# Altium schematic sheet Sheet1.SchDoc
size A4
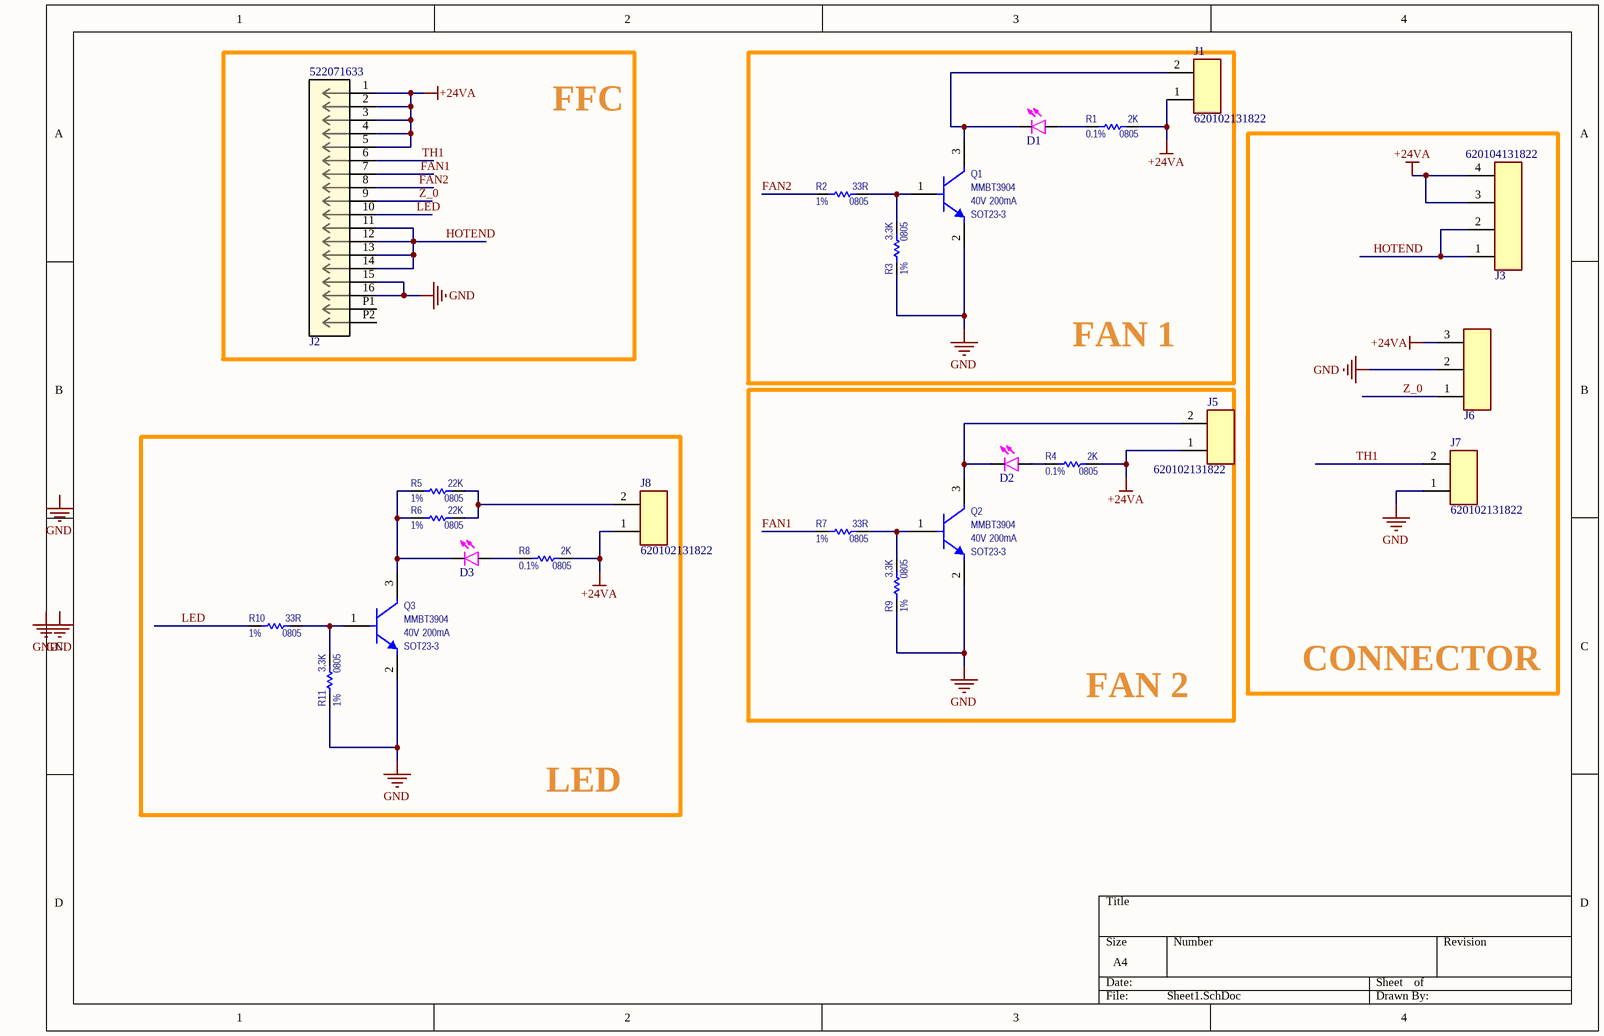
[diagram p0: Sheet1.SchDoc]

## Parts
D1  KP-2012SRC-PRV  [0805 LED]  (value not drawn)
D2  KP-2012SRC-PRV  [0805 LED]  (value not drawn)
D3  KP-2012SRC-PRV  [0805 LED]  (value not drawn)
J1  620102131822  [620102131822]
J2  522071633  [CON_522071633_MOL]
J3  620104131822  [620104131822]
J5  620102131822  [620102131822]
J6  620103131822  [620103131822]  (value not drawn)
J7  620102131822  [620102131822]
J8  620102131822  [620102131822]
Q1  value MMBT3904  Current: 200mA  Voltage: 40V  Package: SOT23-3  [SOT23-3_MMBT3904,215]  (hidden comment: SingleNPN_B1E2C3)
Q2  value MMBT3904  Current: 200mA  Voltage: 40V  Package: SOT23-3  [SOT23-3_MMBT3904,215]  (hidden comment: SingleNPN_B1E2C3)
Q3  value MMBT3904  Current: 200mA  Voltage: 40V  Package: SOT23-3  [SOT23-3_MMBT3904,215]  (hidden comment: SingleNPN_B1E2C3)
R1  value 2K  Tolerance: 0.1%  Package: 0805  [R_0805_GEN_0.70H]  (hidden comment: StandardResistor)
R2  value 33R  Tolerance: 1%  Package: 0805  [R_0805_GEN_0.70H]  (hidden comment: StandardResistor)
R3  value 3.3K  Tolerance: 1%  Package: 0805  [R_0805_GEN_0.70H]  (hidden comment: StandardResistor)
R4  value 2K  Tolerance: 0.1%  Package: 0805  [R_0805_GEN_0.70H]  (hidden comment: StandardResistor)
R5  value 22K  Tolerance: 1%  Package: 0805  [R_0805_GEN_0.70H]  (hidden comment: StandardResistor)
R6  value 22K  Tolerance: 1%  Package: 0805  [R_0805_GEN_0.70H]  (hidden comment: StandardResistor)
R7  value 33R  Tolerance: 1%  Package: 0805  [R_0805_GEN_0.70H]  (hidden comment: StandardResistor)
R8  value 2K  Tolerance: 0.1%  Package: 0805  [R_0805_GEN_0.70H]  (hidden comment: StandardResistor)
R9  value 3.3K  Tolerance: 1%  Package: 0805  [R_0805_GEN_0.70H]  (hidden comment: StandardResistor)
R10  value 33R  Tolerance: 1%  Package: 0805  [R_0805_GEN_0.70H]  (hidden comment: StandardResistor)
R11  value 3.3K  Tolerance: 1%  Package: 0805  [R_0805_GEN_0.70H]  (hidden comment: StandardResistor)

## Blocks framed on the sheet
FFC: J2
FAN 1: D1 J1 Q1 R1-R3
CONNECTOR: J3 J6 J7
FAN 2: D2 J5 Q2 R4 R7 R9
LED: D3 J8 Q3 R5 R6 R8 R10 R11

## Nets
+24VA: J1.1 J2.1 J2.2 J2.3 J2.4 J2.5 J3.3 J3.4 J5.1 J6.3 J8.1 R1.2 R4.2 R8.2
GND: J2.15 J2.16 J6.2 J7.1 Q1.2(EMITTER) Q2.2(EMITTER) Q3.2(EMITTER) R3.1 R9.1 R11.1
FAN1: J2.7 R7.1
FAN2: J2.8 R2.1
HOTEND: J2.11 J2.12 J2.13 J2.14 J3.1 J3.2
LED: J2.10 R10.1
TH1: J2.6 J7.2
Z_0: J2.9 J6.1
NetD1_A: D1.A R1.1
NetD1_K: D1.K(C) J1.2 Q1.3(COLLECTOR)
NetD2_A: D2.A R4.1
NetD2_K: D2.K(C) J5.2 Q2.3(COLLECTOR)
NetD3_A: D3.A R8.1
NetD3_K: D3.K(C) Q3.3(COLLECTOR) R5.1 R6.1
NetJ8_2: J8.2 R5.2 R6.2
NetQ1_1: Q1.1(BASE) R2.2 R3.2
NetQ2_1: Q2.1(BASE) R7.2 R9.2
NetQ3_1: Q3.1(BASE) R10.2 R11.2

Not connected (* = marked no-connect by the designer): J2 P1 P2

## Notes on the sheet
- Labels drawn without touching a wire or pin: GND

## Library data of the parts
D1-D3 = KP-2012SRC-PRV: KP-2012SRC-PRV Red LED, 640 nm 2012 (0805), Rectangle Lens SMD package; Manufacturer: Kingbright; Lens Color: Clear; Viewing Angle: 120°; Lens Style: Rectangular,Diffused,Colorless; Number of LEDs: 1; Wavelength: 640nm; Luminous Intensity: 100mcd; Forward Voltage: 1.85V; Forward Current: 20mA; Supplier 1: Farnell; Manufacturer Part Number: KP-2012SRC-PRV; RoHS: Yes; Category: LEDs; Pricing 1: 5=0,12900, 50=0,10200, 100=0,09830, 500=0,08370, 1000=0,07290 (EUR); Mount: Surface Mount; Case/Package: 2012; Number of Pins: 2; Color: Red; Min Operating Temperature: -40°C; Max Operating Temperature: 85°C; Packaging: Cut Tape; Dominant Wavelength: 640nm; Radiation Hardening: No; Reach SVHC Compliant: Yes; RoHS Compliant: Yes; ComponentLink1URL: https://datasheet.ciiva.com/14176/kp2012src-prv-eng-tds-14176962.pdf?src-supplier=Distrelec; ComponentLink1Description: https://datasheet.ciiva.com/14176/kp2012src-prv-eng-tds-14176962.pdf?src-supplier=Distrelec; ComponentLink2URL: https://datasheet.ciiva.com/11773/0900766b8032fa8d-11773524.pdf?src-supplier=RSComponents; ComponentLink2Description: https://datasheet.ciiva.com/11773/0900766b8032fa8d-11773524.pdf?src-supplier=RSComponents; ComponentLink3URL: https://datasheet.ciiva.com/14634/0900766b8032fa8d-14634746.pdf?src-supplier=Allied+Electronics; ComponentLink3Description: https://datasheet.ciiva.com/14634/0900766b8032fa8d-14634746.pdf?src-supplier=Allied+Electronics; ComponentLink4URL: https://datasheet.ciiva.com/29281/180105-da-01-en-led-0805-typ-kp-2012src-prv-29281248.pdf?src-supplier=Conrad; ComponentLink4Description: https://datasheet.ciiva.com/29281/180105-da-01-en-led-0805-typ-kp-2012src-prv-29281248.pdf?src-supplier=Conrad; Supplier Part Number 1: 1318244
J1 J5 J7 J8 = 620102131822: Connector Header Surface Mount, Right Angle 2 position 0.079 _2.00mm_; MF: Wurth Electronics; MP: 620102131822; Price: None; SnapEDA_Link: https://www.snapeda.com/parts/620102131822/Wurth%20Electronics%20Inc./view-part/424042/?ref=snap; Package: None; Value: *; Availability: Unavailable
J2 = 522071633: No Description Available; Mfr_Name: Molex Connector Corporation; RefDes: RefDes; Type: Type
J3 = 620104131822: <b> WR-WTB 2.00mm SMT Male Horizontal Shrouded Header, 4 Pins</b>=>Code : Con_WTB_2.00_PCB_SMT_620104131822 <br><a href="http://katalog.we-online.de/media/thumbs2/eican/thb_Con_WTB_2.00_PCB_SMT_6201xx131822_pf2.jpg" title="Enlarge picture"> <img src="http://katalog.we-online.de/media/thumbs2/eican/thb_Con_WTB_2.00_PCB_SMT_6201xx131822_pf2.jpg"  width="320"></a><p> Details see: <a href="http://katalog.we-online.de/en/em/WTB_2_00_SMT_MALE_HORIZONTAL_SHROUDED_HEADER_6201XX131822">http://katalog.we-online.de/en/em/WTB_2_00_SMT_MALE_HORIZONTAL_SHROUDED_HEADER_6201XX131822</a><p> Created 2014-06-05, Karrer Zheng<br> 2014 (C) WÃ¼rth Elektronik; Package: None; Price: None; Value: *; MP: 620104131822; Availability: Unavailable
J6 = 620103131822: Connector Header Surface Mount, Right Angle 3 position 0.079 (2.00mm); MF: Wurth Electronics; MP: 620103131822; SnapEDA_Link: https://www.snapeda.com/parts/620103131822/Wurth%20Electronics%20Inc./view-part/1330579/?ref=snap; Mouser-Purchase-URL: https://snapeda.com/shop?store=Mouser&id=1330579; Price: None; Availability: Warning; Package: None; Value: *
Q1-Q3 = NPN_40V-200mA_#1: TRA_NPN_SING_40V_200mA_VSAT300mV_SOT23-3; Manufacturer#1: Nexperia; Manufacturer#1 PN: MMBT3904,215; Manufacturer#2 PN: MMBT3904-7-F; Similar Part: SST3904HZGT116; PMBT3904,235; Added by: HasanA; FireANTs Code: Q00012; Failure in Time: 0.44@[60%CL; 55°C; 0.7eV]; Grade Level: Industrial; Lead Status: Pb-Free; Location: 4D3; Max Reflow Duration: 30; Max Reflow Temp: 260; Placement Area: 14.00; Power Rating: X; Temp# Operating: -65°C/+150°C; Identifier: NPN_40V-200mA_#1; Checked by: EserC; ComponentLink1Description: Resource Folder; ComponentLink1URL: C:\BNA_Repo\HW_Lib\trunk\ComponentLibrary\Resources\Transistors\Q00012; Cost: 0.10; Features: Single NPN signal BJT; Height: 1.10; Manufacturer#2: Diodes; MSL: 1; Mounting Type: SMD; Part Status: Active; Temp# Storage: -65°C/+150°C; Tolerance: X; Weight: 7.48mg
R1 R4 R8 = STD_2K_#7: RES_STD_2K_0.125W_0.1%_25ppm_0805; Manufacturer#1: Panasonic; Manufacturer#1 PN: ERA-6AEB202V; Manufacturer#2 PN: RG2012P-202-B-T5; Similar Part: ERA-6ARB202V; Added by: İlhanT; FireANTs Code: R00087; Current: X; Grade Level: Automotive; Lead Status: Pb-Free; Location: 2C22; Max Reflow Duration: 10; Max Reflow Temp: 260; Placement Area: 10.45; Power Rating: 125mW; Temp# Operating: -55°C/+155°C; Voltage: 100V; Identifier: STD_2K_#7; Checked by: YasinY; ComponentLink1Description: Resource Folder; ComponentLink1URL: C:\FireANTs_Repo\HW_Lib\trunk\ComponentLibrary\Resources\Resistors\R00087; Cost: 0.31; Failure in Time: N/A; Features: AEC-Q200; Height: 0.70; Manufacturer#2: Susumu; MSL: 1; Mounting Type: SMD; Part Status: Active; Temp# Storage: N/A; Weight: 5.5mg
R2 R5-R7 R10 = STD_33R_#3: RES_STD_33R_0.125W_1%_100ppm_0805; Manufacturer#1: Yageo; Manufacturer#1 PN: AC0805FR-0733RL; Manufacturer#2 PN: ERJ-6ENF33R0V; Added by: HasanA; FireANTs Code: R00051; Current: X; Grade Level: Automotive; Lead Status: Pb-Free; Location: 2C13; Max Reflow Duration: 10; Max Reflow Temp: 260; Placement Area: 10.45; Power Rating: 125mW; Temp# Operating: -55°C/+155°C; Voltage: 150V; Identifier: STD_33R_#3; Checked by: YasinY; ComponentLink1Description: Resource Folder; ComponentLink1URL: C:\FireANTs_Repo\HW_Lib\trunk\ComponentLibrary\Resources\Resistors\R00051; Cost: 0.10; Failure in Time: N/A; Features: AEC-Q200; Height: 0.70; Manufacturer#2: Panasonic; MSL: 1; Mounting Type: SMD; Part Status: Active; Similar Part: N/A; Temp# Storage: N/A; Weight: 5.5mg
R3 R9 R11 = STD_3.3K_#3: RES_STD_3.3K_0.125W_1%_100ppm_0805; Manufacturer#1: Yageo; Manufacturer#1 PN: AC0805FR-073K3L; Manufacturer#2 PN: ERJ-6ENF3301V; Added by: HasanA; FireANTs Code: R00131; Current: X; Grade Level: Automotive; Lead Status: Pb-Free; Location: 2G8; Max Reflow Duration: 10; Max Reflow Temp: 260; Placement Area: 10.45; Power Rating: 125mW; Temp# Operating: -55°C/+155°C; Voltage: 150V; Identifier: STD_3.3K_#3; Checked by: YasinY; ComponentLink1Description: Resource Folder; ComponentLink1URL: C:\FireANTs_Repo\HW_Lib\trunk\ComponentLibrary\Resources\Resistors\R00131; Cost: 0.10; Failure in Time: N/A; Features: AEC-Q200; Height: 0.70; Manufacturer#2: Panasonic; MSL: 1; Mounting Type: SMD; Part Status: Active; Similar Part: N/A; Temp# Storage: N/A; Weight: 5.5mg